# EAGLE schematic WCP05_draft design_1_0 (EAGLE 9.5.0)
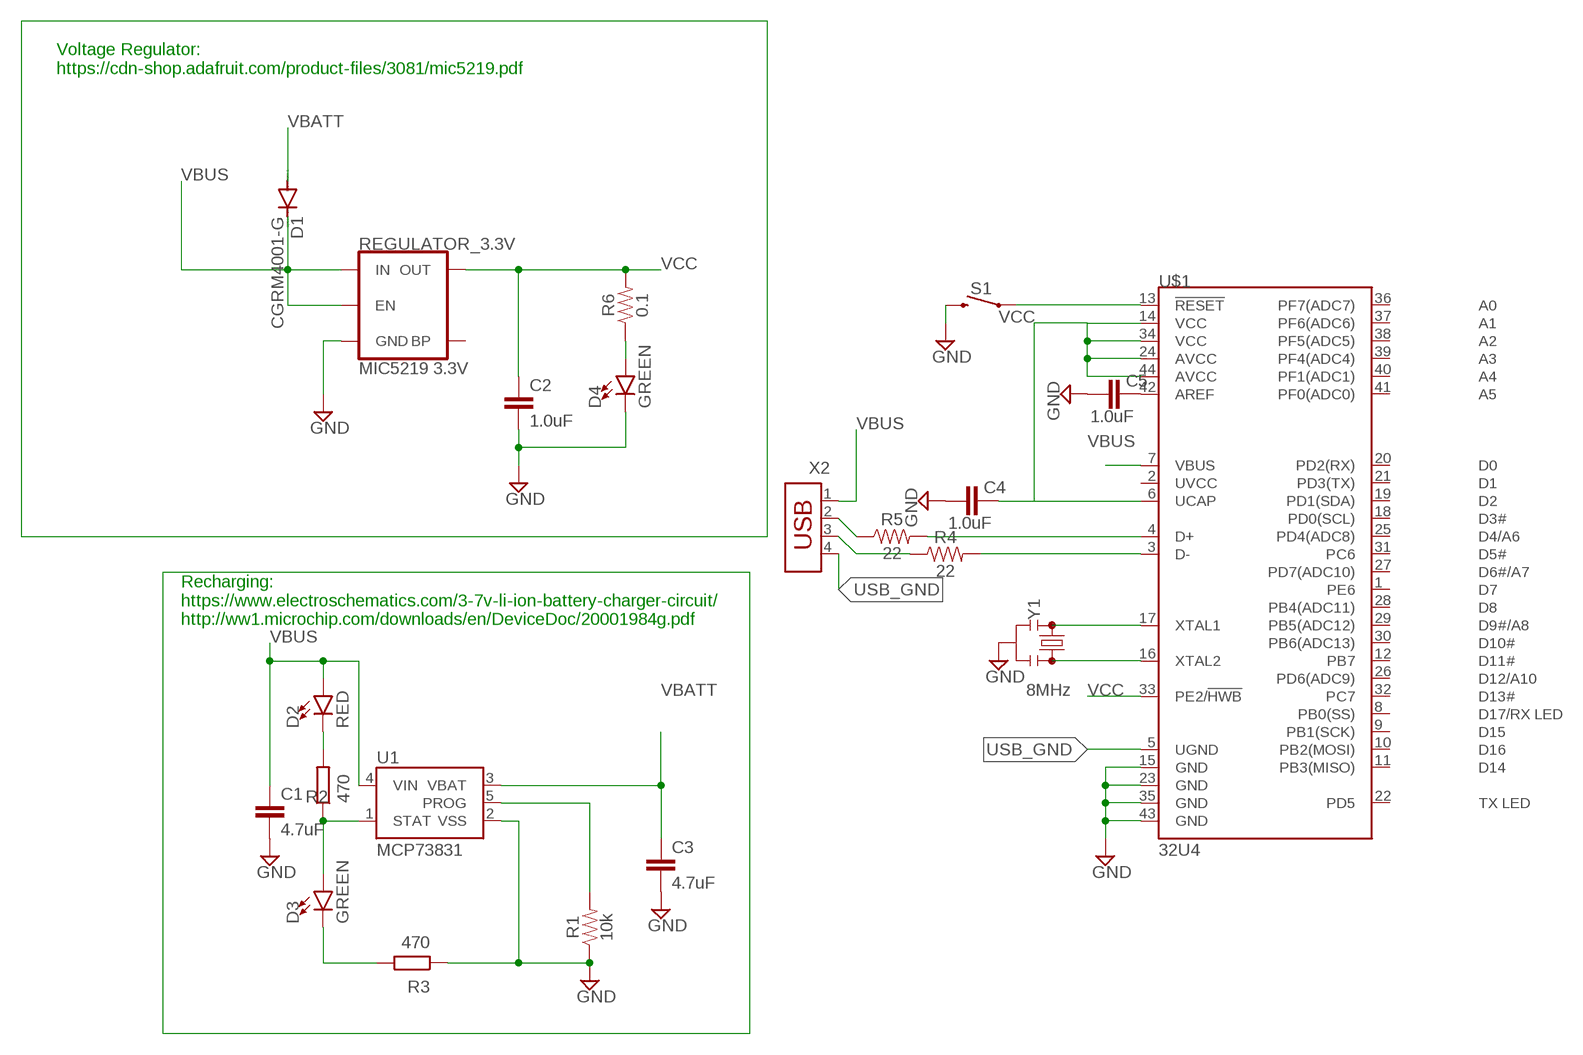
[diagram p0: schematic, sheet 1]

## Parts
C1  4.7uF  4.7UF-1206-16V-(+80/-20%)  [1206]
C2  1.0uF  1.0UF-0603-16V-10%  [0603]
C3  4.7uF  4.7UF-1206-16V-(+80/-20%)  [1206]
C4  1.0uF  1.0UF-1206-50V-10%  [1206]
C5  1.0uF  1.0UF-1206-50V-10%  [1206]
D1  CGRM4001-G  [SOD-123_MINI-SMA]
D2  RED  LED-RED1206  [LED-1206]
D3  GREEN  LED-GREEN1206  [LED-1206]
D4  GREEN  LED-GREENLILYPAD  [LED-1206]
R1  10k  10KOHM-0603-1/10W-1%  [0603]
R2  470  R  (no package)
R3  470  R  (no package)
R4  22  22OHM-0603-1/10W-1%  [0603]
R5  22  22OHM-0603-1/10W-1%  [0603]
R6  0.1  0.1OHM-1210-1/2W-1%  [1210]
REGULATOR_3.3V  MIC5219 3.3V  V_REG_MIC52193.3V  [SOT23-5]
S1  MOMENTARY-SWITCH-SPST-SMD-4.5MM  [TACTILE_SWITCH_SMD_4.5MM]
U1  MCP73831  [SOT23-5]
U$1  32U4  ATMEGA32U4QFN  [QFN-44]
X2  USB-787616  [USB]
Y1  8MHz  RESONATOR-8MHZSMD_3.2X1.3  [RESONATOR-SMD-3.2X1.3]

## Nets
GND: C1.2 C2.2 C3.2 C4.2 C5.2 D4.C R1.1 R3.1 REGULATOR_3.3V.2(GND) S1.1 S1.4 U1.2(VSS) U$1.15(GND) U$1.23(GND) U$1.35(GND) U$1.43(GND) Y1.2
N$1: R1.2 U1.5(PROG)
N$2: R5.1 X2.2
N$3: R5.2 U$1.4(D+)
N$4: D3.A R2.1 U1.1(STAT)
N$6: D2.C R2.2
N$7: D3.C R3.2
N$9: S1.2 S1.3 U$1.13(!RESET)
N$10: D4.A R6.1
N$11: R4.2 U$1.3(D-)
N$12: R4.1 X2.3
N$13: C5.1 U$1.42(AREF)
N$14: U$1.16(XTAL2) Y1.3
N$15: U$1.17(XTAL1) Y1.1
USB_GND: U$1.5(UGND) X2.4
VBATT: C3.1 D1.A U1.3(VBAT)
VBUS: C1.1 D1.C D2.A REGULATOR_3.3V.1(IN) REGULATOR_3.3V.3(EN) U1.4(VIN) U$1.7(VBUS) X2.1
VCC: C2.1 C4.1 R6.2 REGULATOR_3.3V.5(OUT) U$1.6(UCAP) U$1.14(VCC) U$1.24(AVCC) U$1.33(PE2/!HWB) U$1.34(VCC) U$1.44(AVCC)
Unconnected: REGULATOR_3.3V.4(BP) U$1.1(PE6) U$1.2(UVCC) U$1.8(PB0(SS)) U$1.9(PB1(SCK)) U$1.10(PB2(MOSI)) U$1.11(PB3(MISO)) U$1.12(PB7) U$1.18(PD0(SCL)) U$1.19(PD1(SDA)) U$1.20(PD2(RX)) U$1.21(PD3(TX)) U$1.22(PD5) U$1.25(PD4(ADC8)) U$1.26(PD6(ADC9)) U$1.27(PD7(ADC10)) U$1.28(PB4(ADC11)) U$1.29(PB5(ADC12)) U$1.30(PB6(ADC13)) U$1.31(PC6) U$1.32(PC7) U$1.36(PF7(ADC7)) U$1.37(PF6(ADC6)) U$1.38(PF5(ADC5)) U$1.39(PF4(ADC4)) U$1.40(PF1(ADC1)) U$1.41(PF0(ADC0))

## Notes on the sheet
- Voltage Regulator:
  https://cdn-shop.adafruit.com/product-files/3081/mic5219.pdf
- Recharging:
  https://www.electroschematics.com/3-7v-li-ion-battery-charger-circuit/
  http://ww1.microchip.com/downloads/en/DeviceDoc/20001984g.pdf

## Library data of the parts
C1 C3 = SparkFun-Capacitors:4.7UF: 4.7µF ceramic capacitors A capacitor is a passive two-terminal electrical component used to store electrical energy temporarily in an electric field.; PROD_ID: CAP-10300
C2 = SparkFun-Capacitors:1.0UF: 1µF ceramic capacitors A capacitor is a passive two-terminal electrical component used to store electrical energy temporarily in an electric field.; PROD_ID: CAP-00868
C4 C5 = SparkFun-Capacitors:1.0UF: 1µF ceramic capacitors A capacitor is a passive two-terminal electrical component used to store electrical energy temporarily in an electric field.; PROD_ID: CAP-09822
D1 = diode:CGRM400*-G: Molded plasitc,JEDEC SOD-123/Mini SMA Source: Comchip CGRM4001-G.pdf
D2 = SparkFun-LED:LED-RED: Red SMD LED Used in manufacturing of most products at SparkFun Packages: 0603 - SMD 0603 package [Product Link] <http://docs.avagotech.com/docs/AV02-0551EN> 0603 SMART - SMD 0603 SMART package ( more efficient and expensive)[Product Link] <http://www.osram-os.com/Graphics/XPic2/00077099_0.pdf> 1206 - SMD1206 package [Product Link] <https://www.sparkfun.com/datasheets/DevTools/LilyPad/Q150OVS4.pdff> SparkFun Products: Pro Mini 328 -5V <https://www.sparkfun.com/products/821> RedBoard <https://www.sparkfun.com/products/12757> IOIO-OTG <https://www.sparkfun.com/products/13613>; PROD_ID: DIO-09912
D3 = SparkFun-LED:LED-GREEN: Green SMD LED Used in manufacturing of various products at SparkFun Packages: 0603 - SMD 0603 package [Product Link] <http://www.futureelectronics.com/en/technologies/semiconductors/optoelectronics/leds/Pages/9894312-LTST-C190GKT.aspx?CrossPart=HSMG-C190&IM=0> LilyPad 1206 - SMD1206 LilyPad package [Product Link] <http://www.futureelectronics.com/en/Technologies/Product.aspx?ProductID=IN150NGHARVATEKCORPORATION2049943&IM=0> 1206 - SMD1206 package [Product Link] <http://www.futureelectronics.com/en/technologies/semiconductors/optoelectronics/leds/Pages/8315665-LTST-C150KGKT.aspx?IM=0> 1206 Bottom Mount -SMD 1206 Bottom Mount [Product Link] <http://www.digikey.com/product-detail/en/lite-on-inc/LTST-C230KGKT/160-1456-1-ND/386854> SparkFun Products: Pro Mini 328 -5V <https://www.sparkfun.com/products/821> RedBoard <https://www.sparkfun.com/products/12757> MP3 Trigger <https://www.sparkfun.com/products/13720> Makey Makey <https://www.sparkfun.com/products/11076>; PROD_ID: DIO-00862
D4 = SparkFun-LED:LED-GREEN: Green SMD LED Used in manufacturing of various products at SparkFun Packages: 0603 - SMD 0603 package [Product Link] <http://www.futureelectronics.com/en/technologies/semiconductors/optoelectronics/leds/Pages/9894312-LTST-C190GKT.aspx?CrossPart=HSMG-C190&IM=0> LilyPad 1206 - SMD1206 LilyPad package [Product Link] <http://www.futureelectronics.com/en/Technologies/Product.aspx?ProductID=IN150NGHARVATEKCORPORATION2049943&IM=0> 1206 - SMD1206 package [Product Link] <http://www.futureelectronics.com/en/technologies/semiconductors/optoelectronics/leds/Pages/8315665-LTST-C150KGKT.aspx?IM=0> 1206 Bottom Mount -SMD 1206 Bottom Mount [Product Link] <http://www.digikey.com/product-detail/en/lite-on-inc/LTST-C230KGKT/160-1456-1-ND/386854> SparkFun Products: Pro Mini 328 -5V <https://www.sparkfun.com/products/821> RedBoard <https://www.sparkfun.com/products/12757> MP3 Trigger <https://www.sparkfun.com/products/13720> Makey Makey <https://www.sparkfun.com/products/11076>; PROD_ID: DIO-09910
R1 = SparkFun-Resistors:10KOHM: 10kΩ resistor A resistor is a passive two-terminal electrical component that implements electrical resistance as a circuit element. Resistors act to reduce current flow, and, at the same time, act to lower voltage levels within circuits. - Wikipedia; PROD_ID: RES-00824
R2 R3 = ngspice-simulation:R: RESISTOR
R4 R5 = SparkFun-Resistors:22OHM: 22Ω resistor A resistor is a passive two-terminal electrical component that implements electrical resistance as a circuit element. Resistors act to reduce current flow, and, at the same time, act to lower voltage levels within circuits. - Wikipedia; PROD_ID: RES-08698
R6 = SparkFun-Resistors:0.1OHM: 0.1Ω resistor A resistor is a passive two-terminal electrical component that implements electrical resistance as a circuit element. Resistors act to reduce current flow, and, at the same time, act to lower voltage levels within circuits. - Wikipedia; PROD_ID: RES-12374
REGULATOR_3.3V = SparkFun-IC-Power:V_REG_MIC5219: V_REG MIC5219 Standard 3.3V and 5V 500mA LDO voltage regulator in SOT-23 layout. Micrel part MIC5219. BP (by-pass) pin is used to lower output noise with 470pF cap, may be left open.; PROD_ID: VREG-09872
S1 = SparkFun-Switches:MOMENTARY-SWITCH-SPST: Momentary Switch (Pushbutton) - SPST Normally-open (NO) SPST momentary switches (buttons, pushbuttons). Variants PTH-12MM - 12mm square, through-hole Momentary Pushbutton Switch - 12mm Square <https://www.sparkfun.com/products/9190> (COM-09190) PTH-6.0MM, PTH-6.0MM-KIT - 6.0mm square, through-hole Mini Pushbutton Switch <https://www.sparkfun.com/products/97> (COM-00097) KIT package intended for soldering kit's - only one side of pads' copper is exposed. PTH-RIGHT-ANGLE-KIT - Right-angle, through-hole Right Angle Tactile Button <https://www.sparkfun.com/products/10791> - Used on SparkFun BigTime Watch Kit <https://www.sparkfun.com/products/11734> SMD-12MM - 12mm square, surface-mount Tactile Button - SMD (12mm) <https://www.sparkfun.com/products/12993> (COM-12993) Used on SparkFun PicoBoard <https://www.sparkfun.com/products/11888> SMD-4.5MM - 4.5mm Square Trackball Switch Used on SparkFun Blackberry Trackballer Breakout <https://www.sparkfun.com/products/13169> SMD-4.6MMX2.8MM - 4.60mm x 2.80mm, surface mount Used on SparkFun SAMD21 Mini Breakout <https://www.sparkfun.com/products/13664> SMD-5.2MM, SMD-5.2-REDUNDANT - 5.2mm square, surface-mount Mini Pushbutton Switch - SMD <https://www.sparkfun.com/products/8720> (COM-08720) Used on Arduino Pro Mini <https://www.sparkfun.com/products/11114> REDUNDANT package connects both switch circuits together SMD-6.0X3.5MM - 6.0 x 3.5mm, surface mount Momentary Reset Switch SMD <https://www.sparkfun.com/products/8229> (COM-08229) SMD-6.2MM-TALL - 6.2mm square, surface mount Tactile Button - SMD (6mm) <https://www.sparkfun.com/products/12992> Used on SparkFun Digital Sandbox <https://www.sparkfun.com/products/12651> SMD-RIGHT-ANGLE - Right-angle, surface mount Used on SparkFun Block for Intel® Edison - Arduino <https://www.sparkfun.com/products/13036>; PROD_ID: SWCH-09213
U1 = SparkFun-IC-Power:MCP73831: MCP73831T Li-Ion, Li-Pol Controller Miniature single cell, fully integrated Li-Ion, Li-polymer charge management controller Datasheet <http://ww1.microchip.com/downloads/en/DeviceDoc/20001984g.pdf> SparkFun Products: SparkFun ESP32 Thing <https://www.sparkfun.com/products/13907> SparkFun 9DoF Razor IMU M0 <https://www.sparkfun.com/products/14001>; PROD_ID: IC-09995
U$1 = SparkFun-IC-Microcontroller:ATMEGA32U4: Atmel MCU, 32KByte Atmel 44-pin 8-bit Microcontroller with 32KBytes of ISP Flash and USB Controller Datasheet <http://cdn.sparkfun.com/datasheets/Dev/Arduino/Boards/ATMega32U4.pdf> SparkFun Products LilyPad Arduino USB - ATmega32U4 Board <https://www.sparkfun.com/products/12049> (DEV-12049) Pro Micro - 5V/16MHz <https://www.sparkfun.com/products/12640> (DEV-12640) Pro Micro - 3.3V/8MHz <https://www.sparkfun.com/products/12587> (DEV-12587) Fio v3 - ATmega32U4 <https://www.sparkfun.com/products/11520> (DEV-11520) Qduino Mini <https://www.sparkfun.com/products/13614> (DEV-13614) Makey Makey - Standard Kit <https://www.sparkfun.com/products/11511> (WIG-11511) Makey Makey Deluxe Kit <https://www.sparkfun.com/products/11519> (WIG-11519); PROD_ID: IC-10828
X2 = con-amp:USB-787616: AMP connector
Y1 = SparkFun-Clocks:RESONATOR-8MHZ: 8MHz Resonator Digikey Example <http://www.digikey.com/product-detail/en/murata-electronics-north-america/CSTCE10M0G55-R0/490-1196-1-ND/584633> Frequency: 8MHz Frequency Stability: ±0.2% Frequency Tolerance: ±0.5% Capacitance: 33pF SparkFun Products Arduino Pro Mini 328- 3.3V/8MHz <https://www.sparkfun.com/products/11114> SparkFun Digital Sandbox <https://www.sparkfun.com/products/12651>; PROD_ID: XTAL-08895